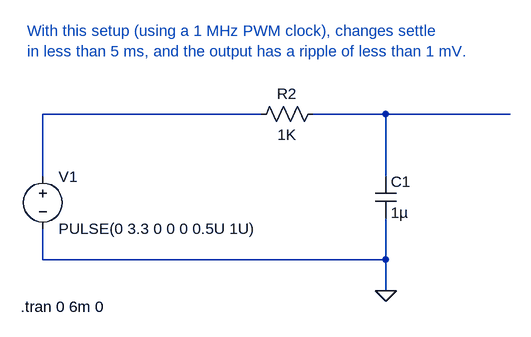
[diagram p0: schematic pwm.asc]
pwm.asc, the LTspice schematic file:
Version 4
SHEET 1 1440 680
WIRE 384 48 48 48
WIRE 576 48 464 48
WIRE 768 48 576 48
WIRE 48 144 48 48
WIRE 576 144 576 48
WIRE 48 272 48 224
WIRE 576 272 576 208
WIRE 576 272 48 272
WIRE 576 320 576 272
FLAG 576 320 0
SYMBOL voltage 48 128 R0
WINDOW 123 0 0 Left 0
WINDOW 39 0 0 Left 0
SYMATTR InstName V1
SYMATTR Value PULSE(0 3.3 0 0 0 0.5U 1U)
SYMBOL cap 560 144 R0
SYMATTR InstName C1
SYMATTR Value 1µ
SYMBOL res 480 32 R90
WINDOW 0 0 56 VBottom 2
WINDOW 3 32 56 VTop 2
SYMATTR InstName R2
SYMATTR Value 1K
TEXT 14 344 Left 2 !.tran 0 6m 0
TEXT 24 -80 Left 2 ;With this setup (using a 1 MHz PWM clock), changes settle\nin less than 5 ms, and the output has a ripple of less than 1 mV.

The netlist it stands for:
* pwm.asc
V1 N001 0 PULSE(0 3.3 0 0 0 0.5U 1U)
C1 N002 0 1µ
R2 N002 N001 1K
.tran 0 6m 0
* With this setup (using a 1 MHz PWM clock), changes settle
* in less than 5 ms, and the output has a ripple of less than 1 mV.
.backanno
.end